# EAGLE design p0rx-001 (EAGLE 9.6.2)
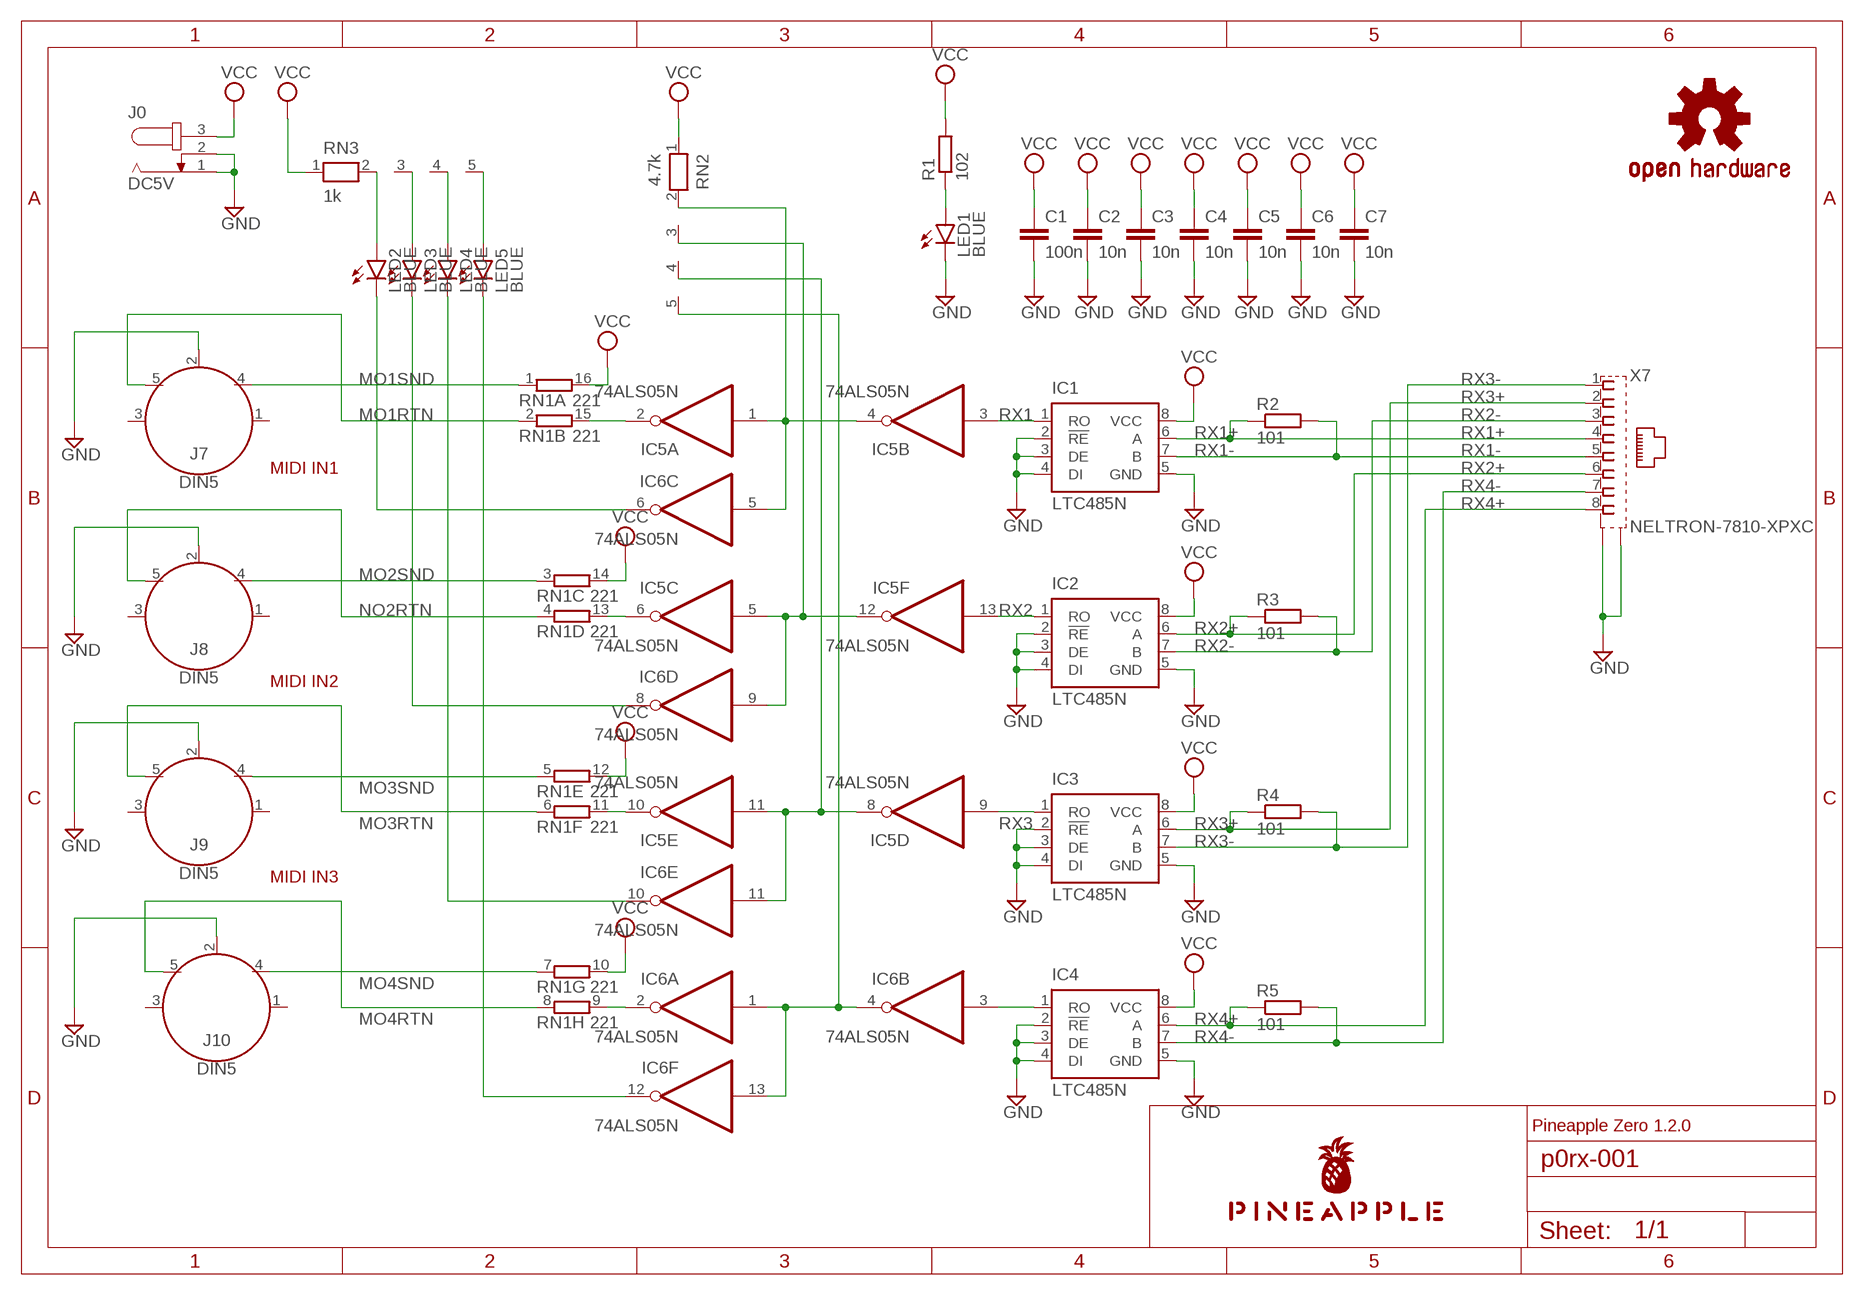
[diagram p0: schematic, sheet 1]

## Parts
C1  100n  C-EU025-024X044  [C025-024X044]
C2  10n  C-EU025-024X044  [C025-024X044]
C3  10n  C-EU025-024X044  [C025-024X044]
C4  10n  C-EU025-024X044  [C025-024X044]
C5  10n  C-EU025-024X044  [C025-024X044]
C6  10n  C-EU025-024X044  [C025-024X044]
C7  10n  C-EU025-024X044  [C025-024X044]
IC1  LTC485N  [DIL08]
IC2  LTC485N  [DIL08]
IC3  LTC485N  [DIL08]
IC4  LTC485N  [DIL08]
IC5  74ALS05N  [DIL14]
IC6  74ALS05N  [DIL14]
J0  DC5V  JACK-PLUG0  [SPC4077]
J7  DIN5  [DIN5-RA-PTH]
J8  DIN5  [DIN5-RA-PTH]
J9  DIN5  [DIN5-RA-PTH]
J10  DIN5  [DIN5-RA-PTH]
LED1  BLUE  LED3MM  [LED3MM]
LED2  BLUE  LED3MM  [LED3MM]
LED3  BLUE  LED3MM  [LED3MM]
LED4  BLUE  LED3MM  [LED3MM]
LED5  BLUE  LED3MM  [LED3MM]
LOGO1  OSHW-LOGOS-COPPER  [OSHW-LOGO-S_COPPER]
R1  102  R-EU_0204/5  [0204/5]
R2  101  R-EU_0204/5  [0204/5]
R3  101  R-EU_0204/5  [0204/5]
R4  101  R-EU_0204/5  [0204/5]
R5  101  R-EU_0204/5  [0204/5]
RN1  221  8R-N  [DIL16]
RN2  4.7k  RN04  [RN-5]
RN3  1k  RN04  [RN-5]
U$1  PINEAPPLE450  [PINEAPPLE450]
X7  NELTRON-7810-XPXC  [NELTRON-7810-XPXC-FOOTPRINT]

## Nets
GND [gnd]: C1.2 C2.2 C3.2 C4.2 C5.2 C6.2 C7.2 IC1.2(!RE) IC1.3(DE) IC1.4(DI) IC1.5(GND) IC2.2(!RE) IC2.3(DE) IC2.4(DI) IC2.5(GND) IC3.2(!RE) IC3.3(DE) IC3.4(DI) IC3.5(GND) IC4.2(!RE) IC4.3(DE) IC4.4(DI) IC4.5(GND) J0.1 J0.2 J7.2 J8.2 J9.2 J10.2 LED1.K(C) X7.S1 X7.S2
MO1RTN: J7.5 RN1.2
MO1RTNRAW: IC5.2(A:O) RN1.15
MO1SND: J7.4 RN1.1
MO2RTNRAW: IC5.6(C:O) RN1.13
MO2SND: J8.4 RN1.3
MO3RTN: J9.5 RN1.6
MO3RTNRAW: IC5.10(E:O) RN1.11
MO3SND: J9.4 RN1.5
MO4RTN: J10.5 RN1.8
MO4SND: J10.4 RN1.7
N$1: IC6.1(A:I) IC6.4(B:O) IC6.13(F:I) RN2.5
N$2: IC4.1(RO) IC6.3(B:I)
N$4: LED1.A R1.1
N$6: IC6.2(A:O) RN1.9
N$7: LED2.A RN3.2
N$8: LED3.A RN3.3
N$9: LED4.A RN3.4
N$10: LED5.A RN3.5
N$11: IC6.6(C:O) LED2.K(C)
N$12: IC6.8(D:O) LED3.K(C)
N$13: IC6.10(E:O) LED4.K(C)
N$14: IC6.12(F:O) LED5.K(C)
NO2RTN: J8.5 RN1.4
RX1: IC1.1(RO) IC5.3(B:I)
RX1+: IC1.6(A) R2.1 X7.4
RX1-: IC1.7(B) R2.2 X7.5
RX1R: IC5.1(A:I) IC5.4(B:O) IC6.5(C:I) RN2.2
RX2: IC2.1(RO) IC5.13(F:I)
RX2+: IC2.6(A) R3.1 X7.6
RX2-: IC2.7(B) R3.2 X7.3
RX2R: IC5.5(C:I) IC5.12(F:O) IC6.9(D:I) RN2.3
RX3: IC3.1(RO) IC5.9(D:I)
RX3+: IC3.6(A) R4.1 X7.2
RX3-: IC3.7(B) R4.2 X7.1
RX3R: IC5.8(D:O) IC5.11(E:I) IC6.11(E:I) RN2.4
RX4+: IC4.6(A) R5.1 X7.8
RX4-: IC4.7(B) R5.2 X7.7
VCC [pwr]: C1.1 C2.1 C3.1 C4.1 C5.1 C6.1 C7.1 IC1.8(VCC) IC2.8(VCC) IC3.8(VCC) IC4.8(VCC) J0.3 R1.2 RN1.10 RN1.12 RN1.14 RN1.16 RN2.1 RN3.1
Unconnected: J7.1 J7.3 J8.1 J8.3 J9.1 J9.3 J10.1 J10.3

## Notes on the sheet
- MIDI IN1
- MIDI IN2
- MIDI IN3
- Pineapple Zero 1.2.0

## Power pins joined to a net without a drawn wire
GND: IC5.7(P:GND) IC6.7(P:GND)
VCC: IC5.14(P:VCC) IC6.14(P:VCC)

## Library data of the parts
C1-C7 = rcl:C-EU: CAPACITOR, European symbol; SPICEPREFIX: C
IC1-IC4 = linear-technology:LTC485: Low Power RS485 Interface Transceiver Source: http://www.linear.com/pc/downloadDocument.do?navId=H0,C1,C1007,C1017,P2064,D1718; OC_FARNELL: unknown; OC_NEWARK: unknown
IC5 IC6 = 74xx-us:74*05: Hex INVERTER, open collector
J0 = con-jack:JACK-PLUG: DC POWER JACK Power Jack, DC, Right Angle, Through Hole, Rated 5A at 16VDC, PC Terminals Distributor: Farnell (www.Farnell.de) Drawing: 84N1161.pdf / 84N1162.pdf Manufacturer: SPC Technology (www.spctechnology.com) Type: SPC4077 / SPC 4078; OC_FARNELL: unknown; OC_NEWARK: unknown
J7-J10 = SparkFun-Connectors:DIN5: DIN5 Connector - Female Right Angle (frequently used as a MIDI Jack connector) This type of connector and cable is frequently used for transmitting midi data (musical instrument digital interface). It is what you usually see on a keyboard or set of electronic drums. Learn more here <https://en.wikipedia.org/wiki/MIDI>. For more information on the pinout and electrical specifications of MIDI communications, please see the following resource: https://www.midi.org/specifications/item/midi-din-electrical-specification Here is the connector we sell at SparkFun: MIDI Connector - Female Right Angle <https://www.sparkfun.com/products/9536> (PRT-09536) Datasheet <hhttp://www.sparkfun.com/datasheets/Prototyping/Connectors/MIDI-RA.pdf> It is used on this SparkFun product: SparkFun MIDI Shield <https://www.sparkfun.com/products/12898> (DEV-12898); PROD_ID: CONN-09481
LED1-LED5 = led:LED: LED OSRAM: - CHIPLED LG R971, LG N971, LY N971, LG Q971, LY Q971, LO R971, LY R971 LH N974, LH R974 LS Q976, LO Q976, LY Q976 LO Q996 - Hyper CHIPLED LW Q18S LB Q993, LB Q99A, LB R99A - SideLED LS A670, LO A670, LY A670, LG A670, LP A670 LB A673, LV A673, LT A673, LW A673 LH A674 LY A675 LS A676, LA A676, LO A676, LY A676, LW A676 LS A679, LY A679, LG A679 - Hyper Micro SIDELED® LS Y876, LA Y876, LO Y876, LY Y876 LT Y87S - SmartLED LW L88C, LW L88S LB L89C, LB L89S, LG L890 LS L89K, LO L89K, LY L89K LS L896, LA L896, LO L896, LY L896 - TOPLED LS T670, LO T670, LY T670, LG T670, LP T670 LSG T670, LSP T670, LSY T670, LOP T670, LYG T670 LG T671, LOG T671, LSG T671 LB T673, LV T673, LT T673, LW T673 LH T674 LS T676, LA T676, LO T676, LY T676, LB T676, LH T676, LSB T676, LW T676 LB T67C, LV T67C, LT T67C, LS T67K, LO T67K, LY T67K, LW E67C LS E67B, LA E67B, LO E67B, LY E67B, LB E67C, LV E67C, LT E67C LW T67C LS T679, LY T679, LG T679 LS T770, LO T770, LY T770, LG T770, LP T770 LB T773, LV T773, LT T773, LW T773 LH T774 LS E675, LA E675, LY E675, LS T675 LS T776, LA T776, LO T776, LY T776, LB T776 LHGB T686 LT T68C, LB T68C - Hyper Mini TOPLED® LB M676 - Mini TOPLED Santana® LG M470 LS M47K, LO M47K, LY M47K Source: http://www.osram.convergy.de LUXEON: - LUMILED® LXK2-PW12-R00, LXK2-PW12-S00, LXK2-PW14-U00, LXK2-PW14-V00 LXK2-PM12-R00, LXK2-PM12-S00, LXK2-PM14-U00 LXK2-PE12-Q00, LXK2-PE12-R00, LXK2-PE12-S00, LXK2-PE14-T00, LXK2-PE14-U00 LXK2-PB12-K00, LXK2-PB12-L00, LXK2-PB12-M00, LXK2-PB14-N00, LXK2-PB14-P00, LXK2-PB14-Q00 LXK2-PR12-L00, LXK2-PR12-M00, LXK2-PR14-Q00, LXK2-PR14-R00 LXK2-PD12-Q00, LXK2-PD12-R00, LXK2-PD12-S00 LXK2-PH12-R00, LXK2-PH12-S00 LXK2-PL12-P00, LXK2-PL12-Q00, LXK2-PL12-R00 Source: www.luxeon.com KINGBRIGHT: KA-3528ASYC Source: www.kingbright.com
LOGO1 = SparkFun-Aesthetics:OSHW-LOGO: Open-Source Hardware (OSHW) Logo This logo indicates the piece of hardware it is found on incorporates a OSHW license and/or adheres to the definition of open source hardware found here: http://freedomdefined.org/OSHW
R1-R5 = rcl:R-EU_: RESISTOR, European symbol; SPICEPREFIX: R
RN1 = resistor-dil:8R-N: DIL RESISTOR; OC_FARNELL: unknown; OC_NEWARK: unknown
RN2 RN3 = resistor-net:RN04: RESISTOR NETWORK; OC_FARNELL: unknown; OC_NEWARK: unknown
U$1 = pineapple:PINEAPPLE450
X7 = con-rj45:NELTRON-7810-XPXC: Mod. Jack, Right Angle, 8 posiotion, 8 contatcs RJ45 Source: GLX-S-88M.pdf

## Net classes
0 default: width 0.152 mm, drill 0.152 mm, clearance 0.152 mm
1 pwr: width 0.305 mm, drill 0.152 mm, clearance 0.152 mm
2 gnd: width 0.305 mm, drill 0.152 mm, clearance 0.152 mm

## Board
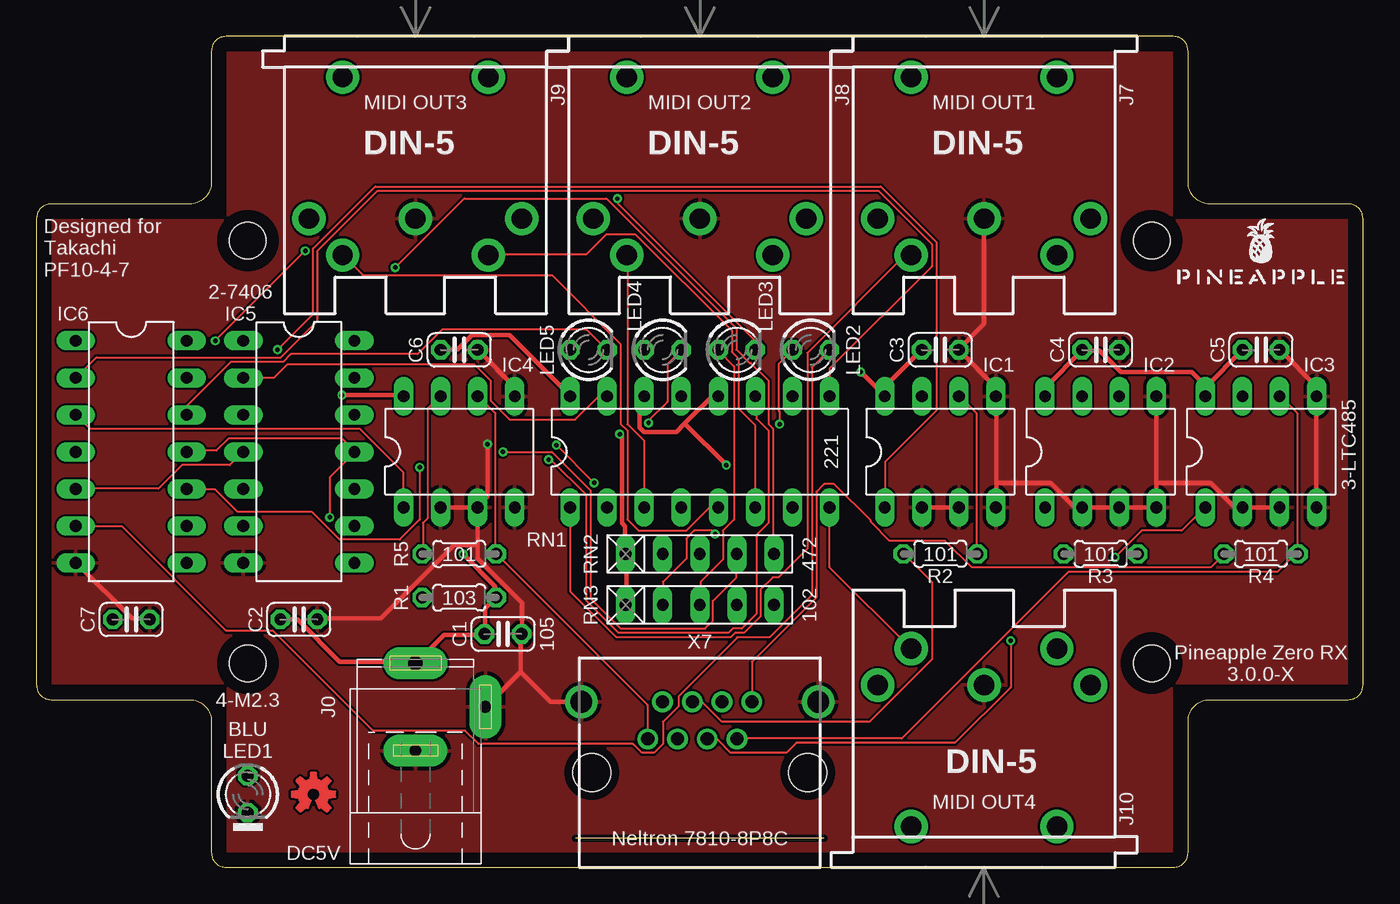
[diagram p1: board, top side]
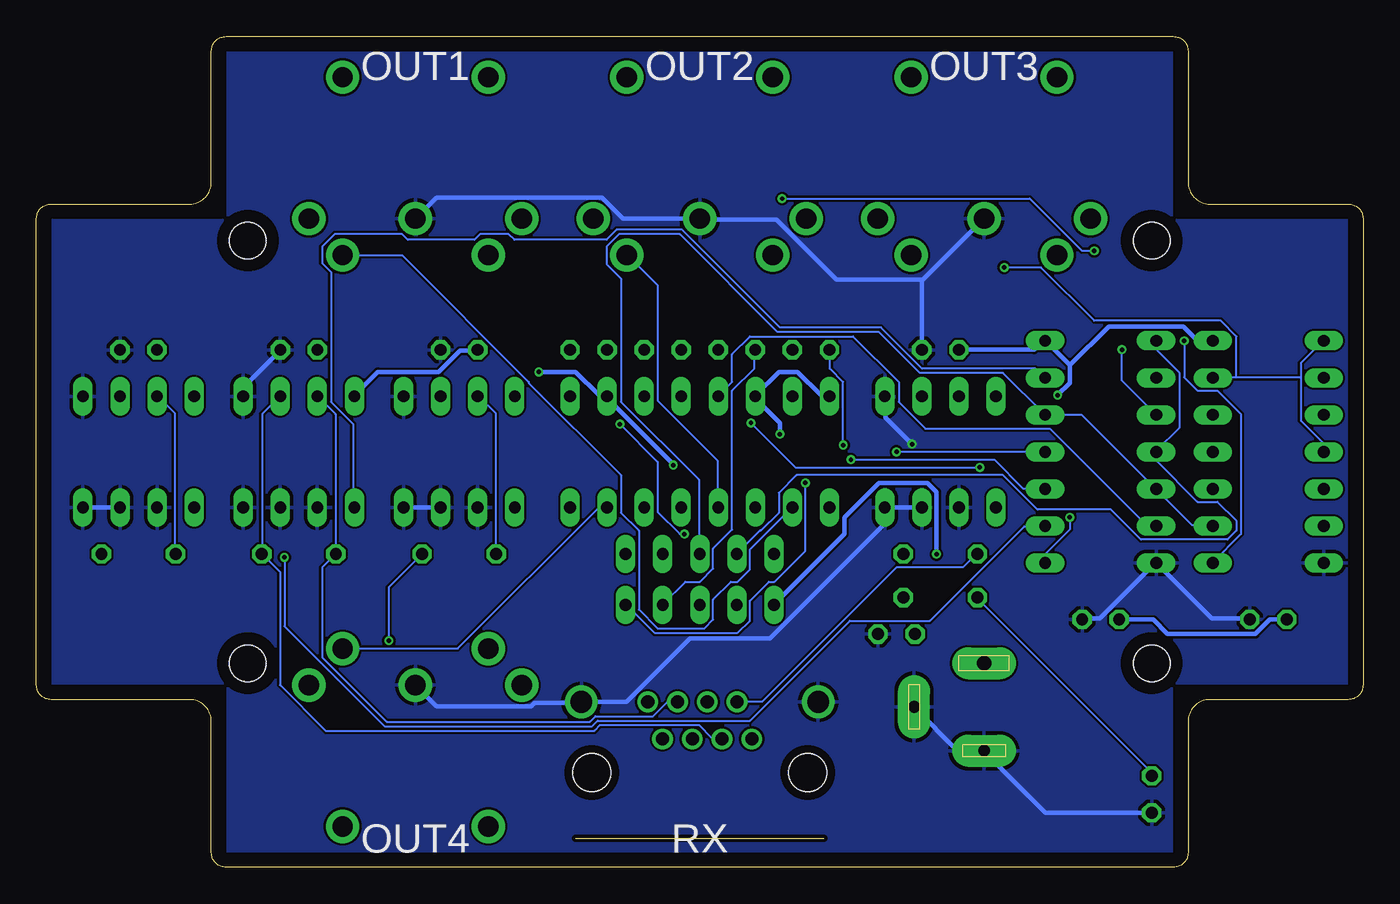
[diagram p2: board, bottom side, seen from below]

Size 91 x 57 mm. Coordinates in mm from the lower left corner, seen from the top.
Outline: 1,11.5 10.5,11.5 arc-90 12,10 12,1 arc90 13,0 78,0 arc90 79,1 79,10 arc-90 80.5,11.5 90,11.5 arc90 91,12.5 91,44.5 arc90 90,45.5 80.5,45.5 arc-90 79,47 79,56 arc90 78,57 13,57 arc90 12,56 12,47 arc-90 10.5,45.5 1,45.5 arc90 0,44.5 0,12.5 arc90 1,11.5
Copper layers (1*16): Top 0.035mm / dielectric 1.5mm / Bottom 0.035mm
Design rules "SeeedStudio_2layer_DRU_no_angle_20140221": minimum track width 6mil, minimum drill 12mil, track to track 6mil, track to pad 6mil, pad to pad 6mil, via to via 6mil, smd to smd 0mil, copper to edge 10mil, drill to drill 10mil, minimum pad ring 10mil, minimum via ring 6mil, stop-mask expansion 2mil, vias tented up to drill 100mil, thermal gap 10mil
Holes 2.5 mm at 14.5,14 76.5,14 76.5,43 14.5,43
tRestrict: area 0,11.5 to 1,45.5; area 0,44.5 to 13,45.5; area 12,44.5 to 13,57; area 12,56 to 79,57; area 78,44.5 to 79,57; area 78,44.5 to 91,45.5; area 90,11.5 to 91,45.5; area 78,11.5 to 91,12.5; area 78,0 to 79,12.5; area 12,0 to 79,1; area 12,0 to 13,12.5; area 0,11.5 to 13,12.5; 4 more areas
bRestrict: area 12,56 to 79,57; area 90,11.5 to 91,45.5; area 12,0 to 79,1; area 0,11.5 to 1,45.5; area 12.5,12 to 16.5,16; area 12,44.5 to 13,57; area 78,44.5 to 79,57; area 12,0 to 13,12.5; area 78,0 to 79,12.5; area 0,44.5 to 13,45.5; area 0,11.5 to 13,12.5; area 78,11.5 to 91,12.5; 4 more areas

### Footprints (pad centres in the part's own frame; a part is rotated, then mirrored left to right if it is on the bottom)
C025-024X044 = drill 0.813 octagon: 1 -1.27,0; 2 1.27,0
DIL08 = drill 0.813 long: 1 -3.81,-3.81; 2 -1.27,-3.81; 3 1.27,-3.81; 4 3.81,-3.81; 5 3.81,3.81; 6 1.27,3.81; 7 -1.27,3.81; 8 -3.81,3.81
DIL14 = drill 0.813 long: 1 -7.62,-3.81; 2 -5.08,-3.81; 3 -2.54,-3.81; 4 0,-3.81; 5 2.54,-3.81; 6 5.08,-3.81; 7 7.62,-3.81; 8 7.62,3.81; 9 5.08,3.81; 10 2.54,3.81; 11 0,3.81; 12 -2.54,3.81; 13 -5.08,3.81; 14 -7.62,3.81
SPC4077 = drill 0.8 pad 2.184 long: 1 -3,0; 2 0,-4.8 | drill 1 pad 2.184 long: 3 3,0
DIN5-RA-PTH = drill 1.4 pad 2.286: 1 7.3,12.5; 2 0,12.5; 3 -7.3,12.5; 4 5,15; 5 -5,15; 6 -5,2.8; 7 5,2.8
LED3MM = drill 0.813 octagon: A -1.27,0; K 1.27,0
0204/5 = drill 0.813 octagon: 1 -2.54,0; 2 2.54,0
DIL16 = drill 0.813 long: 1 -8.89,-3.81; 2 -6.35,-3.81; 3 -3.81,-3.81; 4 -1.27,-3.81; 5 1.27,-3.81; 6 3.81,-3.81; 7 6.35,-3.81; 8 8.89,-3.81; 9 8.89,3.81; 10 6.35,3.81; 11 3.81,3.81; 12 1.27,3.81; 13 -1.27,3.81; 14 -3.81,3.81; 15 -6.35,3.81; 16 -8.89,3.81
RN-5 = drill 0.813 long: 1 -5.08,0; 2 -2.54,0; 3 0,0; 4 2.54,0; 5 5.08,0
NELTRON-7810-XPXC-FOOTPRINT = drill 0.9 pad 1.422: 1 -3.57,-4.84; 2 -2.55,-2.3; 3 -1.53,-4.84; 4 -0.51,-2.3; 5 0.51,-4.84; 6 1.53,-2.3; 7 2.55,-4.84; 8 3.57,-2.3 | drill 1.5 pad 2.184: S1 -8.125,-4.84; S2 8.125,-4.84 | hole 2.6: -7.4,0; 7.4,0

### Placement (x,y rotation side)
C1  32,16 0 top
C2  18,17 0 top
C3  62,35.5 0 top
C4  73,35.5 0 top
C5  84,35.5 0 top
C6  29,35.5 0 top
C7  6.5,17 0 top
IC1  62,28.5 0 top
IC2  73,28.5 0 top
IC3  84,28.5 0 top
IC4  29,28.5 0 top
IC5  18,28.5 270 top
IC6  6.5,28.5 270 top
J0  26,11 90 top
J7  65,57 180 top
J8  45.5,57 180 top
J9  26,57 180 top
J10  65,0 0 top
LED1  14.5,5 270 top
LED2  53.12,35.5 0 top
LED3  48.04,35.5 0 top
LED4  42.96,35.5 0 top
LED5  37.88,35.5 0 top
LOGO1  19,5 0 top
R1  29,18.5 0 top
R2  62,21.5 180 top
R3  73,21.5 180 top
R4  84,21.5 180 top
R5  29,21.5 180 top
RN1  45.5,28.5 0 top
RN2  45.5,21.5 0 top
RN3  45.5,18 0 top
U$1  84,40 0 top
X7  45.5,6.5 180 top

### Tracks (layer width: path | path; a pad name or v marks a point on that pad's centre or on a via)
GND  (via drill 0.3)
  Top 0.305: IC4.5 32.77,32.38 32.77,32.99 30.33,35.43 C6.2 | IC3.3 82.75,24.69 IC3.2 82.6,24.77 82.14,24.77 80.54,26.36 76.81,26.36 | C5.2 85.34,35.43 87.78,32.99 87.78,32.38 IC3.5 87.78,32.16 87.78,24.77 IC3.4 | IC1.2 63.25,24.69 IC1.3 | 65.84,26.36 65.84,32.16 IC1.5 65.76,32.38 65.76,32.99 63.32,35.43 C3.2 63.32,35.59 65,37.26 65,44.42 J7.2 | 65.84,26.36 65.84,24.77 IC1.4 | 65.84,26.36 69.57,26.36 71.17,24.77 71.63,24.77 IC2.2 71.78,24.69 74.22,24.69 IC2.3 74.37,24.69 IC2.4 76.81,24.84 76.81,26.36 | 76.81,26.36 IC2.5 | C7.2 7.7,17.07 6.55,17.07 2.74,20.88 IC6.7 | IC4.2 30.25,24.69 IC4.3 | 33.22,13.41 33.22,15.93 C1.2 33.3,16.15 33.3,18.14 30.25,21.18 30.25,22.1 | 33.22,13.41 30.86,11.05 J0.2 | 30.25,22.1 30.25,24.54 IC4.3 | 33.22,13.41 35.28,11.35 37.34,11.35 X7.S2 | 30.25,22.1 28.65,22.1 23.62,17.07 19.28,17.07 C2.2 | v30.94,29.03 30.94,25.45 30.33,24.84 IC4.3
  Bottom 0.305: 30.25,40.23 30.25,35.51 C6.2 | 30.25,40.23 26.06,44.42 J9.2 | 30.25,40.23 30.33,40.31 36.12,40.31 40.23,44.42 45.49,44.42 J8.2 45.64,44.5 50.75,44.5 52.2,45.95 63.55,45.95 J7.2 | IC3.4 87.78,24.69 85.34,24.69 IC3.3 | IC2.5 76.81,32.38 76.81,32.92 74.3,35.43 C4.2 | IC1.4 65.76,24.69 63.32,24.69 IC1.3 | C2.2 19.2,17.07 18.06,17.07 14.25,20.88 IC5.7 14.1,20.8 10.36,17.07 7.77,17.07 C7.2 | LED1.K 14.55,3.73 21.79,3.73 25.98,7.92 J0.1 26.14,8 27.81,8 30.79,10.97 J0.2 | J10.2 63.55,11.05 57.07,11.05 56.84,11.28 53.65,11.28 X7.S1 53.49,11.35 50.52,11.35 46.18,15.7 40.69,15.7 32.77,23.62 32.77,24.54 IC4.4 32.77,24.69 30.33,24.69 IC4.3 | v30.94,29.03 32.77,30.86 32.77,32.31 IC4.5
  pour Top: -1,-1 92,-1 92,58 -1,58
  pour Bottom: -2,-2 93,-2 93,59 -2,59
MO1RTN
  Bottom 0.152: RN1.2 39.17,24.69 42.06,21.79 42.06,20.42 42.9,19.58 43.36,19.58 44.58,18.36 44.58,16.99 45.19,16.38 48.39,16.38 49.68,17.68 49.68,23.09 50.9,24.31 50.9,26.9 57.23,33.22 57.23,33.3 65.91,41.99 69.95,41.99 J7.5
MO1RTNRAW
  Top 0.152: RN1.15 39.09,32.31 38.56,32.31 36.96,30.71 32.46,30.71 31.17,32 31.17,33.38 30.02,34.52 17.22,34.52 16.31,33.6 14.25,33.6 IC5.2
MO1SND
  Top 0.152: RN1.1 36.65,24.69 36.65,18.9 39.78,15.77 47.62,15.77 47.93,16.08 48.54,16.08 49.68,17.22 49.68,19.05 50.52,19.89 50.9,19.89 52.88,21.87 52.88,35.28 59.59,41.99 59.97,41.99 J7.4
MO2RTNRAW
  Bottom 0.152: IC5.6 14.25,23.47 14.86,23.47 21.49,30.1 30.02,30.1 31.85,31.93 31.85,33.3 34.98,36.42 42.06,36.42 43.28,35.2 43.28,33.3 44.2,32.38 RN1.13
MO2SND
  Top 0.152: RN1.3 41.68,24.77 41.68,29.26 40.54,30.4 40.54,41.99 J8.4
MO3RTN
  Top 0.152: RN1.6 49.3,24.77 49.3,30.33 48.16,31.47 48.16,34.9 47.7,35.36 47.7,36.8 41.07,43.43 39.09,43.43 37.72,42.06 31.01,42.06 J9.5
MO3RTNRAW  (via drill 0.3)
  Top 0.152: v35.13,27.96 35.28,27.96 37.72,25.53 37.72,18.29 39.93,16.08 47.47,16.08 47.78,16.38 48.39,16.38 49.38,17.37 49.38,22.78 50.22,23.62 50.22,29.95 49.38,30.79 49.38,32.31 RN1.11
  Bottom 0.152: v35.13,27.96 25.3,27.96 23.32,25.98 21.87,25.98 IC5.10
MO3SND
  Top 0.152: RN1.5 46.71,24.69 46.18,24.69 44.58,23.09 41.3,23.09 40.54,23.85 40.54,29.95 40.08,30.4 40.08,35.89 35.36,40.62 22.4,40.62 21.03,41.99 J9.4
MO4RTN
  Top 0.152: RN1.8 54.41,24.69 54.41,20.57 59.97,15.01 J10.5
MO4SND
  Bottom 0.152: RN1.7 51.89,24.69 52.43,24.69 62.1,15.01 69.95,15.01 J10.4
N$1  (via drill 0.3)
  Top 0.152: v24.61,41.15 29.34,45.87 39.09,45.87 48.01,36.96 48.01,35.51 48.92,34.59 49,34.59 50.22,33.38 50.22,30.4 50.52,30.1 50.52,21.57 RN2.5
  Bottom 0.152: 4.27,33.6 4.27,34.59 2.74,36.12 IC6.1 | 4.27,33.6 4.27,30.63 2.74,29.11 2.74,28.57 IC6.4 | 4.27,33.6 8.69,33.6 | 8.69,33.6 10.29,33.6 IC6.13 | v24.61,41.15 22.1,41.15 18.44,37.49 9.75,37.49 8.69,36.42 8.69,33.6
N$2
  Top 0.152: IC4.1 25.15,24.77 25.15,27.13 22.17,30.1 3.66,30.1 2.74,31.01 IC6.3
N$4
  Bottom 0.152: LED1.A 14.55,6.33 14.55,6.55 26.44,18.44 R1.1
N$6
  Top 0.152: RN1.9 54.41,32.38 54.41,34.21 61.42,41.22 61.42,42.75 57.76,46.41 23.39,46.41 19.28,42.29 19.28,37.49 16.76,34.98 4.12,34.98 2.74,33.6 IC6.2
N$7  (via drill 0.3)
  Top 0.152: v46.56,22.86 46.33,23.09 45.11,23.09 44.58,22.55 44.58,21.18 42.98,19.58 42.98,18.06 RN3.2 | v50.98,30.4 50.98,31.24 50.9,31.32 50.9,34.52 51.82,35.43 LED2.A
  Bottom 0.152: v46.56,22.86 46.86,22.86 48.39,24.38 48.39,27.81 v50.98,30.4
N$8
  Top 0.152: RN3.3 45.57,18.06 45.57,19.58 47.09,21.11 47.09,23.09 47.85,23.85 47.85,34.37 46.79,35.43 LED3.A
N$9
  Bottom 0.152: LED4.A 41.76,35.43 41.76,34.21 43.28,32.69 43.28,23.16 44.58,21.87 44.58,20.5 45.49,19.58 46.48,19.58 48.01,18.06 RN3.4
N$10  (via drill 0.3)
  Top 0.152: v38.25,26.36 v35.66,28.96
  Bottom 0.152: v35.66,28.96 35.66,33.3 36.58,34.21 36.58,35.43 LED5.A | v38.25,26.36 38.25,21.72 40.39,19.58 40.77,19.58 42.06,18.29 42.06,16.92 42.9,16.08 48.62,16.08 50.52,17.98 RN3.5
N$11
  Top 0.152: IC6.6 2.74,23.39 5.87,23.39 13.03,16.23 16.23,16.23 23.09,9.37 29.41,9.37 30.33,8.46 40.92,8.46 41.53,7.85 42.37,7.85 42.98,8.46 42.98,9.98 44.04,11.05 44.04,11.73 48.08,15.77 50.29,15.77 53.19,18.67 53.19,34.29 54.33,35.43 LED2.K
N$12  (via drill 0.3)
  Top 0.152: v18.44,42.29 v12.27,36.12 | v39.85,45.87 39.85,45.57 49.3,36.12 LED3.K
  Bottom 0.152: v12.27,36.12 12.27,33.6 11.35,32.69 9.98,32.69 8.38,31.09 8.38,22.86 10.29,20.95 IC6.8 | v18.44,42.29 19.28,42.29 22.86,45.87 v39.85,45.87
N$13  (via drill 0.3)
  Top 0.152: v26.29,27.43 26.29,23.85 24.92,22.48 20.8,22.48 18.9,24.38 13.79,24.38 12.27,25.91 10.36,25.91 IC6.10 | v41.99,30.48 41.99,30.63 43.28,31.93 43.28,34.52 44.2,35.43 LED4.K
  Bottom 0.152: v26.29,27.43 38.94,27.43 v41.99,30.48
N$14
  Top 0.152: IC6.12 10.36,31.09 10.36,31.7 13.34,34.67 16.92,34.67 17.45,35.2 26.14,35.2 27.81,36.88 37.72,36.88 39.09,35.51 LED5.K
NO2RTN
  Bottom 0.152: RN1.4 44.27,24.77 44.27,27.89 48.39,32 48.39,39.93 50.44,41.99 J8.5
RX1  (via drill 0.3)
  Top 0.152: v16.54,35.51 18.97,37.95 18.97,42.44 23.24,46.71 57.91,46.71 61.72,42.9 61.72,31.32 58.22,27.81 58.22,24.77 IC1.1
  Bottom 0.152: v16.54,35.51 16.54,33.38 14.25,31.09 IC5.3
RX1+  (via drill 0.3)
  Top 0.152: R2.1 64.47,21.57 64.47,31.17 63.32,32.31 IC1.6 | v66.83,15.54 66.83,12.34 63.02,8.53 52.12,8.53 51.44,7.85 47.62,7.85 46.71,8.76 46.02,8.76 X7.4
  Bottom 0.152: v66.83,15.54 66.83,19.2 64.54,21.49 R2.1
RX1-
  Top 0.152: X7.5 45.03,11.28 45.72,11.28 47.02,9.98 57.15,9.98 61.42,14.25 61.42,19.58 59.51,21.49 R2.2
  Bottom 0.152: R2.2 59.51,21.57 59.51,31.17 60.66,32.31 IC1.7
RX1R
  Top 0.152: IC6.5 2.74,25.98 8.38,25.98 9.98,27.58 13.26,27.58 14.17,28.5 IC5.4
  Bottom 0.152: IC5.1 14.17,36.12 14.17,35.51 12.57,33.91 12.57,30.18 14.17,28.57 IC5.4 14.17,28.42 14.17,27.89 11.35,25.07 9.98,25.07 8.69,23.77 8.69,23.09 9.3,22.48 15.24,22.48 17.3,24.54 22.33,24.54 24.69,26.9 38.86,26.9 40.08,25.68 40.08,24.31 41.3,23.09 41.38,23.09 42.9,21.57 RN2.2
RX2
  Bottom 0.152: IC2.1 69.27,24.77 69.27,30.4 70.79,31.93 70.79,40.84 71.4,41.45 71.4,42.6 70.56,43.43 65.91,43.43 65.53,43.05 60.96,43.05 60.58,43.43 58.6,43.43 58.22,43.05 51.89,43.05 51.21,43.74 46.71,43.74 40.01,37.03 33.07,37.03 30.25,34.21 22.48,34.21 21.87,33.6 IC5.13
RX2+
  Bottom 0.152: IC2.6 74.3,32.31 75.51,31.09 75.51,21.57 R3.1 75.51,21.49 74.3,20.27 74.3,12.5 71.17,9.37 52.73,9.37 52.35,9.75 45.57,9.75 44.65,8.84 44.04,8.84 X7.6
RX2-
  Bottom 0.152: IC2.7 71.7,32.31 70.48,31.09 70.48,21.57 R3.2 70.48,21.49 71.4,20.57 71.4,14.4 66.98,9.98 53.03,9.98 52.65,10.36 48.69,10.36 47.78,11.28 47.09,11.28 X7.3
RX2R
  Bottom 0.152: IC6.9 10.36,23.47 11.73,23.47 14.17,25.91 IC5.5 14.25,25.98 19.28,31.01 21.79,31.01 IC5.12 21.87,31.09 24.69,33.91 30.4,33.91 33.22,36.73 40.16,36.73 46.86,43.43 51.05,43.43 51.89,42.6 51.89,41.38 50.9,40.39 50.9,31.93 45.57,26.59 45.57,21.57 RN2.3
RX3  (via drill 0.3)
  Top 0.152: v73.99,21.26 75.82,23.09 78.56,23.09 80.16,24.69 IC3.1
  Bottom 0.152: v73.99,21.26 73.99,16.54 67.13,9.68 52.88,9.68 52.5,10.06 42.06,10.06 35.2,16.92 29.72,16.92 23.24,23.39 21.87,23.39 IC5.9
RX3+
  Top 0.152: IC3.6 85.34,32.31 86.49,31.17 86.49,21.57 R4.1 86.41,21.57 85.11,20.27 70.79,20.27 59.36,8.84 48.08,8.84 X7.2
RX3-
  Top 0.152: X7.1 49.07,11.35 49.07,14.1 53.49,18.52 53.49,25.76 54.03,26.29 54.71,26.29 57.23,23.77 57.23,23.7 58.52,22.4 62.33,22.4 64.16,20.57 80.54,20.57 81.46,21.49 R4.2
  Bottom 0.152: R4.2 81.53,21.57 81.53,31.17 82.68,32.31 IC3.7
RX3R  (via drill 0.3)
  Top 0.152: IC6.11 10.36,28.57 12.34,28.57 13.18,29.41 20.95,29.41 21.79,28.57 IC5.11 21.79,28.42 20.12,26.75 v20.12,24 | v32,28.5 35.36,28.5 38.02,25.83 38.02,18.44 40.08,16.38 45.87,16.38 46.41,16.92 46.41,18.29 48.01,19.89 48.01,21.49 RN2.4
  Bottom 0.152: v20.12,24 20.12,23.16 21.79,21.49 21.79,20.95 IC5.8 | v32,28.5 21.87,28.5 IC5.11
RX4+
  Top 0.152: IC4.6 30.33,32.31 31.47,31.17 31.47,21.57 R5.1 31.55,21.49 41.91,11.12 41.91,8.84 X7.8
RX4-
  Top 0.152: R5.2 26.52,21.57 26.52,23.62 26.82,23.93 26.82,31.47 27.66,32.31 IC4.7
  Bottom 0.152: X7.7 42.9,11.35 41.22,11.35 32,20.57 27.43,20.57 26.52,21.49 R5.2
VCC  (via drill 0.3)
  Top 0.305: v56.54,33.98 58.14,32.38 IC1.8 57.91,32.69 60.66,35.43 C3.1 | IC2.8 69.27,32.38 69.27,32.99 71.7,35.43 C4.1 71.86,35.43 72.92,35.43 74.37,33.98 79.25,33.98 80.16,33.07 IC3.8 80.24,32.38 80.24,32.99 82.68,35.43 C5.1 | C2.1 16.76,16.99 17.91,16.99 20.8,14.1 25.91,14.1 J0.3 26.06,14.02 27.96,15.93 30.63,15.93 C1.1 30.79,16 30.79,17.75 31.47,18.44 R1.2 31.47,18.59 31.47,19.28 v29.26,21.49 | v20.95,32.38 25.15,32.38 IC4.8 | RN3.1 40.46,18.06 40.46,21.49 RN2.1 40.39,21.64 40.39,23.39 40.16,23.62 40.16,29.57 v40.01,29.72 | 44.46,30.44 43.89,29.87 41.68,29.87 41.38,30.18 41.38,32 RN1.14 | 44.46,30.44 46.33,32.31 46.71,32.31 RN1.12 | C6.1 28.88,35.51 29.87,36.5 32.46,36.5 36.58,32.38 RN1.16 | 44.46,30.44 v47.32,27.58
  Bottom 0.305: v56.54,33.98 54.03,33.98 52.43,32.38 51.89,32.38 RN1.10 51.82,32.16 47.32,27.66 v47.32,27.58 | C3.1 60.73,35.43 61.95,35.43 63.4,33.98 67.59,33.98 69.19,32.38 IC2.8 | C7.1 5.26,16.99 6.4,16.99 7.39,16 13.41,16 14.4,16.99 16.69,16.99 C2.1 | v20.95,32.38 20.12,33.22 20.12,34.44 | 20.12,34.44 21.79,36.12 IC5.14 21.95,36.12 22.55,35.51 27.66,35.51 C6.1 | 20.12,34.44 17.45,37.11 12.34,37.11 11.43,36.2 10.36,36.2 IC6.14 | RN1.16 36.65,32.38 37.19,32.38 38.79,33.98 40.08,33.98 41.68,32.38 RN1.14 41.68,32.16 40.01,30.48 v40.01,29.72 | v29.26,21.49 29.26,25.76 29.87,26.36 33.22,26.36 35.59,24 35.59,22.86 40.39,18.06 RN3.1

### Text on the board
tNames: MIDI OUT3 | MIDI OUT2 | MIDI OUT1 | Designed for / Takachi / PF10-4-7 | 2-7406 | 3-LTC485 | 221 | 101 | 472 | 101 | 101 | 101 | 103 | 102 | 105 | Pineapple Zero RX / 3.0.0-X | 4-M2.3 | BLU | MIDI OUT4 | Neltron 7810-8P8C | DC5V
bNames: OUT3 | OUT2 | OUT1 | RX | OUT4